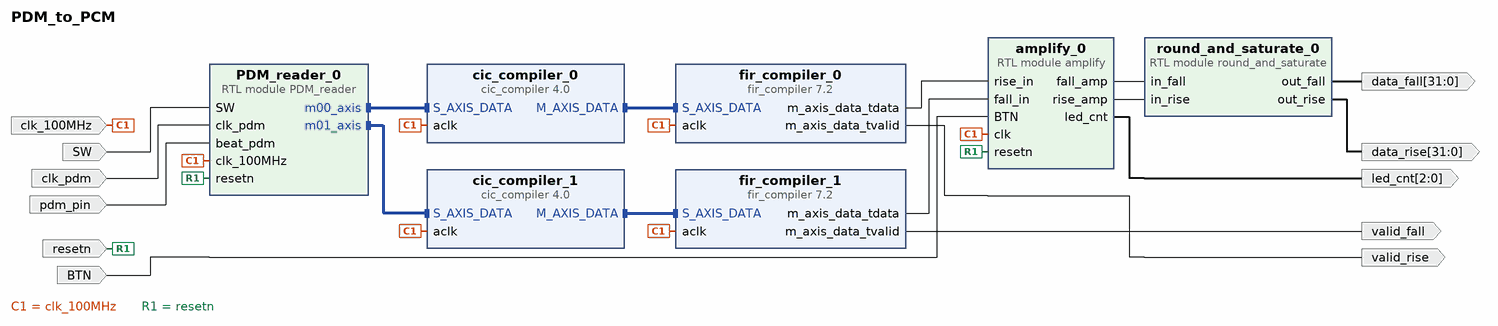
[diagram p0: block diagram of the top level]
# Vivado block design PDM_to_PCM, xc7z020clg400-1, Vivado 2025.1
create_bd_design PDM_to_PCM

create_bd_port -dir I clk_pdm
create_bd_port -dir I pdm_pin
create_bd_port -dir I -type clk clk_100MHz
set_property -dict {CONFIG.FREQ_HZ 100000000} [get_bd_ports clk_100MHz]
create_bd_port -dir I -type rst resetn
create_bd_port -dir O -from 31 -to 0 -type data data_rise
create_bd_port -dir O -from 31 -to 0 -type data data_fall
create_bd_port -dir O valid_rise
create_bd_port -dir O valid_fall
create_bd_port -dir I SW
create_bd_port -dir I BTN
create_bd_port -dir O -from 2 -to 0 led_cnt

create_bd_cell -type module -reference PDM_reader PDM_reader_0
create_bd_cell -type ip -vlnv xilinx.com:ip:cic_compiler:4.0 cic_compiler_0
set_property -dict [list \
  CONFIG.Clock_Frequency 100 \
  CONFIG.Filter_Type Decimation \
  CONFIG.Fixed_Or_Initial_Rate 40 \
  CONFIG.Input_Data_Width 2 \
  CONFIG.Input_Sample_Frequency 3.84 \
  CONFIG.Maximum_Rate 40 \
  CONFIG.Minimum_Rate 40 \
  CONFIG.Number_Of_Stages 5 \
  CONFIG.Output_Data_Width 29 \
  CONFIG.SamplePeriod 1 \
  CONFIG.Use_Xtreme_DSP_Slice true \
] [get_bd_cells cic_compiler_0]
create_bd_cell -type ip -vlnv xilinx.com:ip:fir_compiler:7.2 fir_compiler_0
set_property -dict [list \
  CONFIG.Clock_Frequency 100.0 \
  CONFIG.CoefficientVector 20,-20,15,4,-47,109,-168,185,-112,-81,390,-747,993,-825,-401,4095,-401,-825,993,-747,390,-81,-112,185,-168,109,-47,4,15,-20,20 \
  CONFIG.Coefficient_Fractional_Bits 0 \
  CONFIG.Coefficient_Sets 1 \
  CONFIG.Coefficient_Sign Signed \
  CONFIG.Coefficient_Structure Symmetric \
  CONFIG.Coefficient_Width 16 \
  CONFIG.Data_Width 29 \
  CONFIG.Filter_Architecture Systolic_Multiply_Accumulate \
  CONFIG.Output_Rounding_Mode Full_Precision \
  CONFIG.Output_Width 43 \
  CONFIG.Quantization Integer_Coefficients \
  CONFIG.S_DATA_Has_FIFO false \
  CONFIG.Sample_Frequency 0.096 \
] [get_bd_cells fir_compiler_0]
create_bd_cell -type ip -vlnv xilinx.com:ip:cic_compiler:4.0 cic_compiler_1
set_property -dict [list \
  CONFIG.Clock_Frequency 100 \
  CONFIG.Filter_Type Decimation \
  CONFIG.Fixed_Or_Initial_Rate 40 \
  CONFIG.Input_Data_Width 2 \
  CONFIG.Input_Sample_Frequency 3.84 \
  CONFIG.Maximum_Rate 40 \
  CONFIG.Minimum_Rate 40 \
  CONFIG.Number_Of_Stages 5 \
  CONFIG.Output_Data_Width 29 \
  CONFIG.SamplePeriod 1 \
  CONFIG.Use_Xtreme_DSP_Slice true \
] [get_bd_cells cic_compiler_1]
create_bd_cell -type ip -vlnv xilinx.com:ip:fir_compiler:7.2 fir_compiler_1
set_property -dict [list \
  CONFIG.Clock_Frequency 100.0 \
  CONFIG.CoefficientVector 20,-20,15,4,-47,109,-168,185,-112,-81,390,-747,993,-825,-401,4095,-401,-825,993,-747,390,-81,-112,185,-168,109,-47,4,15,-20,20 \
  CONFIG.Coefficient_Fractional_Bits 0 \
  CONFIG.Coefficient_Sets 1 \
  CONFIG.Coefficient_Sign Signed \
  CONFIG.Coefficient_Structure Symmetric \
  CONFIG.Coefficient_Width 16 \
  CONFIG.Data_Width 29 \
  CONFIG.Filter_Architecture Systolic_Multiply_Accumulate \
  CONFIG.Output_Rounding_Mode Full_Precision \
  CONFIG.Output_Width 43 \
  CONFIG.Quantization Integer_Coefficients \
  CONFIG.S_DATA_Has_FIFO false \
  CONFIG.Sample_Frequency 0.096 \
] [get_bd_cells fir_compiler_1]
create_bd_cell -type module -reference round_and_saturate round_and_saturate_0
create_bd_cell -type module -reference amplify amplify_0

# ---- connections ----

connect_bd_intf_net [get_bd_intf_pins PDM_reader_0/m00_axis] [get_bd_intf_pins cic_compiler_0/S_AXIS_DATA]
connect_bd_intf_net [get_bd_intf_pins PDM_reader_0/m01_axis] [get_bd_intf_pins cic_compiler_1/S_AXIS_DATA]
connect_bd_intf_net [get_bd_intf_pins cic_compiler_0/M_AXIS_DATA] [get_bd_intf_pins fir_compiler_0/S_AXIS_DATA]
connect_bd_intf_net [get_bd_intf_pins fir_compiler_1/S_AXIS_DATA] [get_bd_intf_pins cic_compiler_1/M_AXIS_DATA]
connect_bd_net [get_bd_ports BTN] [get_bd_pins amplify_0/BTN]
connect_bd_net [get_bd_ports SW] [get_bd_pins PDM_reader_0/SW]
connect_bd_net [get_bd_pins amplify_0/fall_amp] [get_bd_pins round_and_saturate_0/in_fall]
connect_bd_net [get_bd_pins amplify_0/led_cnt] [get_bd_ports led_cnt]
connect_bd_net [get_bd_pins amplify_0/rise_amp] [get_bd_pins round_and_saturate_0/in_rise]
connect_bd_net -net clk_100MHz_0_1 [get_bd_ports clk_100MHz] \
  [get_bd_pins cic_compiler_0/aclk] [get_bd_pins cic_compiler_1/aclk] [get_bd_pins fir_compiler_0/aclk] \
  [get_bd_pins fir_compiler_1/aclk] [get_bd_pins PDM_reader_0/clk_100MHz] [get_bd_pins amplify_0/clk]
connect_bd_net -net clk_pdm_0_1 [get_bd_ports clk_pdm] [get_bd_pins PDM_reader_0/clk_pdm]
connect_bd_net [get_bd_pins fir_compiler_0/m_axis_data_tdata] [get_bd_pins amplify_0/rise_in]
connect_bd_net [get_bd_pins fir_compiler_0/m_axis_data_tvalid] [get_bd_ports valid_rise]
connect_bd_net [get_bd_pins fir_compiler_1/m_axis_data_tdata] [get_bd_pins amplify_0/fall_in]
connect_bd_net [get_bd_pins fir_compiler_1/m_axis_data_tvalid] [get_bd_ports valid_fall]
connect_bd_net -net pdm_pin_0_1 [get_bd_ports pdm_pin] [get_bd_pins PDM_reader_0/beat_pdm]
connect_bd_net [get_bd_ports resetn] [get_bd_pins PDM_reader_0/resetn] [get_bd_pins amplify_0/resetn]
connect_bd_net [get_bd_pins round_and_saturate_0/out_fall] [get_bd_ports data_fall]
connect_bd_net [get_bd_pins round_and_saturate_0/out_rise] [get_bd_ports data_rise]

validate_bd_design
save_bd_design
